# Altium schematic sheet Schematic_Analog to digital Converter_Sheet_.schdoc
size 210 x 180 mm
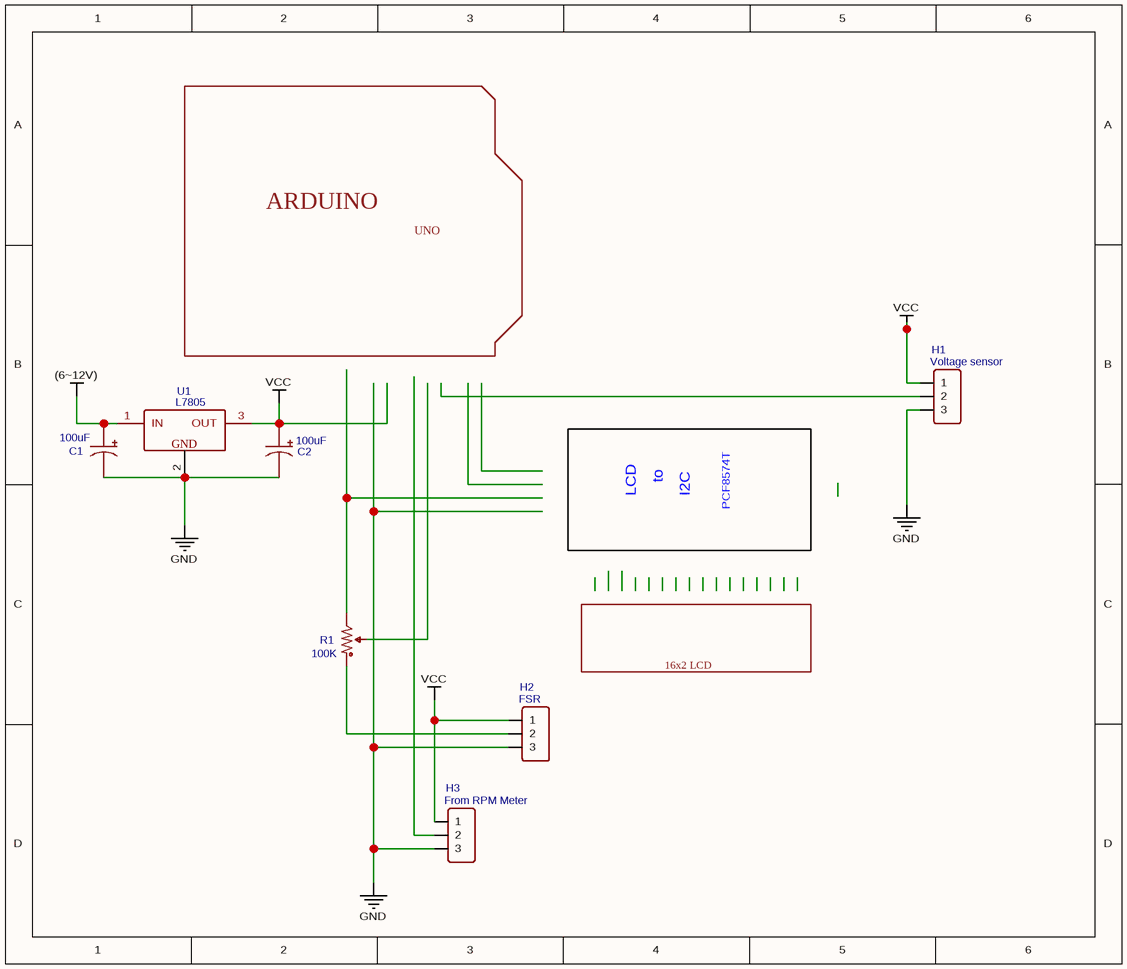
[diagram p0: Schematic_Analog to digital Converter_Sheet_.schdoc]

## Parts
C1  100uF  [CAP-TH_BD8.0-P3.50-D1.0-FD]
C2  100uF  [CAP-TH_BD8.0-P3.50-D1.0-FD]
H1  Voltage sensor  [HDR-TH_3P-P2.54-V]
H2  FSR  [HDR-TH_3P-P2.54-V]
H3  From RPM Meter  [HDR-TH_3P-P2.54-V]
R1  100K  [RES-ADJ_3386P]
U1  L7805  [TO-220(TO-220-3)]

## Nets
(6~12V): C1.1 U1.1(IN)
GND: C1.2 C2.2 H1.3 H2.3 H3.3 U1.2(GND)
VCC: C2.1 H1.1 H2.1 H3.1 U1.3(OUT)
NetH2_2: H2.2 R1.1

Not connected (* = marked no-connect by the designer): H1 2; H3 2; R1 2 3

## Notes on the sheet
- ARDUINO
- UNO
- LCD
- to
- I2C
- PCF8574T
- 16x2 LCD

## Library data of the parts
C1 C2 = 100uF: BOM_Manufacturer: Ymin; BOM_Manufacturer Part: LKMD0901H101MF; nameAlias: Capacitance; Contributor: LCSC; BOM_Supplier: LCSC; BOM_Supplier Part: C442996; spicePre: C; spiceSymbolName: LKMD0901H101MF
H1 = Voltage sensor: BOM_Manufacturer: BOOMELE; BOM_Manufacturer Part: Header2.54mm 1*3P; BOM_Supplier: LCSC; image: //image.lceda.cn/szlcsc/C49257.jpg; BOM_Supplier Part: C49257; spicePre: H; spiceSymbolName: Header-Male-2.54_1x3
H2 = FSR: BOM_Manufacturer: BOOMELE; BOM_Manufacturer Part: Header2.54mm 1*3P; BOM_Supplier: LCSC; image: //image.lceda.cn/szlcsc/C49257.jpg; BOM_Supplier Part: C49257; spicePre: H; spiceSymbolName: Header-Male-2.54_1x3
H3 = From RPM Meter: BOM_Manufacturer: BOOMELE; BOM_Manufacturer Part: Header2.54mm 1*3P; BOM_Supplier: LCSC; image: //image.lceda.cn/szlcsc/C49257.jpg; BOM_Supplier Part: C49257; spicePre: H; spiceSymbolName: Header-Male-2.54_1x3
R1 = 100K: BOM_Manufacturer: Bochen; BOM_Manufacturer Part: 3386P-1-101LF; nameAlias: Resistance(Ohms); Contributor: EasyEDA; BOM_Supplier: LCSC; BOM_Supplier Part: C125022; spicePre: R; spiceSymbolName: 3386P-1-101LF_US
U1 = L7805: BOM_Manufacturer: STMicroelectronics; BOM_Manufacturer Part: L7805ABV; BOM_Supplier: LCSC; image: //image.lceda.cn/szlcsc/C16807.jpg; BOM_Supplier Part: C16807; spicePre: U; spiceSymbolName: L7805ABV